# Altium schematic sheet MCU.SchDoc
size A4; SheetNumber: 2; SheetTotal: 3
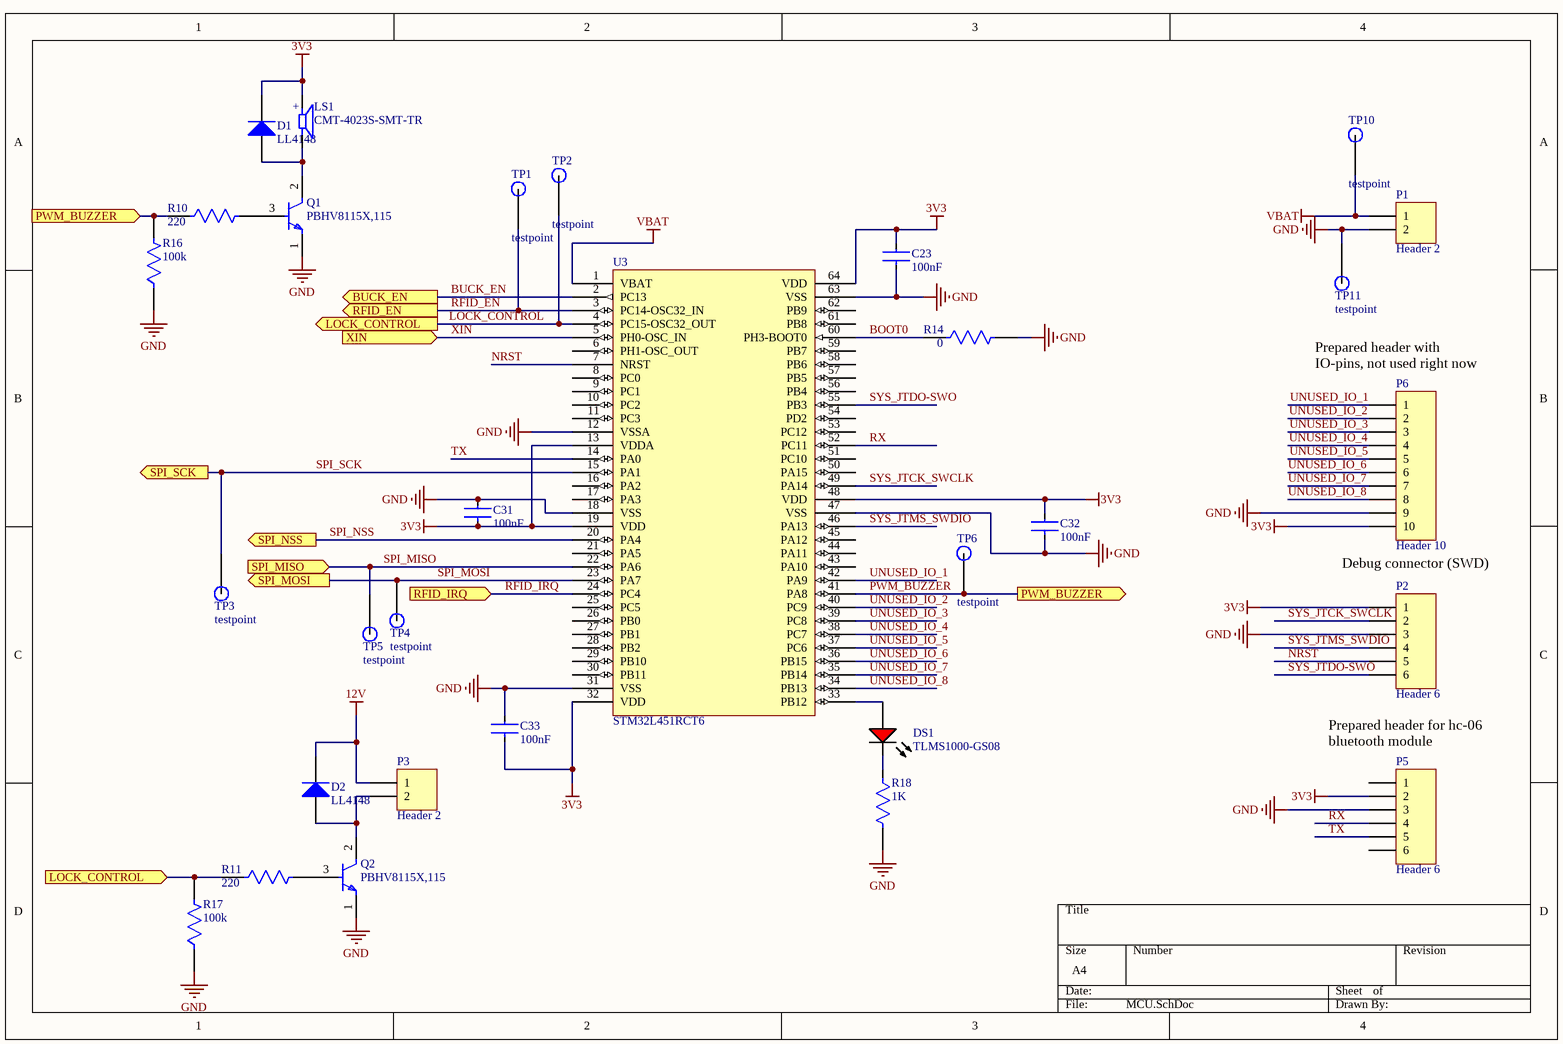
[diagram p0: MCU.SchDoc]

## Parts
C23  100nF  [FP-GCJ21B-0_3-IPC_A]
C31  100nF  [FP-GCJ21B-0_3-IPC_A]
C32  100nF  [FP-GCJ21B-0_3-IPC_A]
C33  100nF  [FP-GCJ21B-0_3-IPC_A]
D1  LL4148  [FAIR-SOD80-2_V]
D2  LL4148  [FAIR-SOD80-2_V]
DS1  TLMS1000-GS08  [VISH-TLMS1000_V]
LS1  CMT-4023S-SMT-TR  [CUI_CMT-4023S-SMT-TR]
P1  Header 2  [HDR1X2]
P2  Header 6  [HDR1X6]
P3  Header 2  [HDR1X2]
P5  Header 6  [HDR1X6]
P6  Header 10  [HDR1X10]
Q1  PBHV8115X,115  [FP-SOT89-MFG]
Q2  PBHV8115X,115  [FP-SOT89-MFG]
R10  220  [FP-AC0603-MFG]
R11  220  [FP-AC0603-MFG]
R14  0  [FP-AC0603-MFG]
R16  100k  [FP-AC0603-MFG]
R17  100k  [FP-AC0603-MFG]
R18  1K  [FP-AC0603-MFG]
TP1  testpoint  [Testpoint]
TP2  testpoint  [Testpoint]
TP3  testpoint  [Testpoint]
TP4  testpoint  [Testpoint]
TP5  testpoint  [Testpoint]
TP6  testpoint  [Testpoint]
TP10  testpoint  [Testpoint]
TP11  testpoint  [Testpoint]
U3  STM32L451RCT6  [LQFP-64]

## Ports
BUCK_EN (out), LOCK_CONTROL (in), LOCK_CONTROL (out), PWM_BUZZER (in), PWM_BUZZER (out), RFID_EN (out), RFID_IRQ (in), SPI_MISO (in), SPI_MOSI (out), SPI_NSS (out), SPI_SCK (out), XIN (in)

## Nets
3V3: C23.2 C31.1 C32.2 C33.1 D1.2(K) LS1.P P2.1 P5.2 P6.10 U3.13(VDDA) U3.19(VDD) U3.32(VDD) U3.48(VDD) U3.64(VDD)
12V: D2.2(K) P3.1
GND: C23.1 C31.2 C32.1 C33.2 P1.2 P2.3 P5.3 P6.9 Q1.1(E) Q2.1(E) R14.2 R16.1 R17.1 R18.2 TP11.1(tp) U3.12(VSSA) U3.18(VSS) U3.31(VSS) U3.47(VSS) U3.63(VSS)
VBAT: P1.1 TP10.1(tp) U3.1(VBAT)
BOOT0: R14.1 U3.60(PH3-BOOT0)
BUCK_EN: U3.2(PC13) ; port BUCK_EN
LOCK_CONTROL: R11.1 R17.2 TP2.1(tp) U3.4(PC15-OSC32_OUT) ; port LOCK_CONTROL
NRST: P2.5 U3.7(NRST)
PWM_BUZZER: R10.1 R16.2 TP6.1(tp) U3.41(PA8) ; port PWM_BUZZER
RFID_EN: TP1.1(tp) U3.3(PC14-OSC32_IN) ; port RFID_EN
RFID_IRQ: U3.24(PC4) ; port RFID_IRQ
RX: P5.4 U3.52(PC11)
SPI_MISO: TP5.1(tp) U3.22(PA6) ; port SPI_MISO
SPI_MOSI: TP4.1(tp) U3.23(PA7) ; port SPI_MOSI
SPI_NSS: U3.20(PA4) ; port SPI_NSS
SPI_SCK: TP3.1(tp) U3.15(PA1) ; port SPI_SCK
SYS_JTCK_SWCLK: P2.2 U3.49(PA14)
SYS_JTDO-SWO: P2.6 U3.55(PB3)
SYS_JTMS_SWDIO: P2.4 U3.46(PA13)
TX: P5.5 U3.14(PA0)
UNUSED_IO_1: P6.1 U3.42(PA9)
UNUSED_IO_2: P6.2 U3.40(PC9)
UNUSED_IO_3: P6.3 U3.39(PC8)
UNUSED_IO_4: P6.4 U3.38(PC7)
UNUSED_IO_5: P6.5 U3.37(PC6)
UNUSED_IO_6: P6.6 U3.36(PB15)
UNUSED_IO_7: P6.7 U3.35(PB14)
UNUSED_IO_8: P6.8 U3.34(PB13)
XIN: U3.5(PH0-OSC_IN) ; port XIN
NetD1_1: D1.1(A) LS1.N Q1.2(C)
NetD2_1: D2.1(A) P3.2 Q2.2(C)
NetDS1_1: DS1.1(A) U3.33(PB12)
NetDS1_2: DS1.2(K) R18.1
NetQ1_3: Q1.3(B) R10.2
NetQ2_3: Q2.3(B) R11.2

Not connected (* = marked no-connect by the designer): P5 1 6; U3 6(PH1-OSC_OUT) 8(PC0) 9(PC1) 10(PC2) 11(PC3) 16(PA2) 17(PA3) 21(PA5) 25(PC5) 26(PB0) 27(PB1) 28(PB2) 29(PB10) 30(PB11) 43(PA10) 44(PA11) 45(PA12) 50(PA15) 51(PC10) 53(PC12) 54(PD2) 56(PB4) 57(PB5) 58(PB6) 59(PB7) 61(PB8) 62(PB9)

## Notes on the sheet
- (near P6) Prepared header with IO-pins, not used right now
- Debug connector (SWD)
- Prepared header for hc-06 bluetooth module
- (in symbol CMT-4023S-SMT-TR) +

## Library data of the parts
C23 C31-C33 = CMP-2007-03210-2: Multilayer Ceramic Capacitors MLCC - SMD/SMT 0805 2.2uF 10%, 16VDC,  X7R 15%; Voltage Rating (DC): 16V; Thickness: 0.057inch; Lead Free: Lead Free; Dielectric: X7R; Case Code (Imperial): 0805; Packaging: Tape and Reel; Features: Soft Termination; Termination: SMD/SMT; Height: 1.25mm; Radiation Hardening: No; Capacitance: 2.2uF; Package Quantity: 1; Min Operating Temperature: -55°C; Ratings: AEC-Q200; Voltage Rating: 16V; Case/Package: 0805; Max Operating Temperature: 125°C; Depth: 1.25mm; Tolerance: 10%; Case Code (Metric): 2012; Length: 2mm; Mount: Surface Mount; Width: 0.049inch
D1 D2 = CMP-2000-05115-2: Small Signal Diode, 100 V, 0.2 A, -55 to 175 degC, 2-Pin SOD80, RoHS, Tape and Reel; Manufacturer: Fairchild; Reverse Voltage-Max [Vrrm]: 100V; Average Forward Current-Max: 200mA; Forward Voltage: 1V; Reverse Recovery Time-Max: 1ns; Power Dissipation: 500mW; Datasheet URL: https://www.fairchildsemi.com/datasheets/LL/LL4148.pdf; Manufacturer URL: https://www.fairchildsemi.com/; Datasheet Version: Rev. 1.8, 01/2016
DS1 = CMP-2000-07254-1: Low Current LED, 40 mW, 1.8 V, -40 to 100 degC, 2-Pin SMD (0603), RoHS, Tape and Reel; Manufacturer: Vishay; Lens Shape: Rectangular; Automotive Qualification Standard: AEC-Q100; Wavelength Typ: 636nm; SVHC: ToBeAdvised; LED Colour: Red; Bulb Size: 1.6mmx0.8mm; Forward Voltage: 1.8V; Luminous Intensity: 4mcd; Forward Current If: 2mA; Viewing Angle: 80°; Datasheet Version: Rev. 1.7, 02/2011; Datasheet URL: https://datasheet.ciiva.com/5798/1698881-5798337.pdf; LED Mounting: SMD; Packaging: CutTape; Package Reference: TLMS1000; Manufacturer URL: http://www.vishay.com/; Mounting Technology: SurfaceMount; Product Range: -; Package Description: 2-Pin Surface Mount Device, Body 1.6 x 0.8 mm; MSL: MSL2-1year
LS1 = CMT-4023S-SMT-TR: 4 mm, 3 Vo-p, 70 dB, Surface Mount _SMT_, Magnetic Audio Transducer Buzzer; MF: CUI Devices; Value: *; Availability: Unavailable; Package: SIP-1 CUI; Price: None; SnapEDA_Link: https://www.snapeda.com/parts/CMT-4023S-SMT-TR/CUI%20Devices/view-part/612102/?ref=snap; MP: CMT-4023S-SMT-TR; CUI_purchase_URL: https://www.cuidevices.com/product/audio/buzzers/audio-transducers/cmt-4023s-smt-tr?utm_source=snapeda.com&utm_medium=referral&utm_campaign=snapedaBOM
P1 P3 = Header 2: Header, 2-Pin; LatestRevisionDate: 17-Jul-2002; LatestRevisionNote: Re-released for DXP Platform.; Publisher: Altium Limited
P2 P5 = Header 6: Header, 6-Pin; LatestRevisionDate: 17-Jul-2002; LatestRevisionNote: Re-released for DXP Platform.; Publisher: Altium Limited
P6 = Header 10: Header, 10-Pin; LatestRevisionDate: 17-Jul-2002; LatestRevisionNote: Re-released for DXP Platform.; Publisher: Altium Limited
Q1 Q2 = CMP-14406-000018-1: TRANS NPN 150V 1A SOT89; Manufacturer: Nexperia; Number Of Npn: 1; Rise Time Tr: 565ns; Delay Time Td: 7ns; Rthja Max: 240K/W; Emitter Base Voltage: 6V; Hfe Testvce: 10V; Collector Emitter Saturation Voltage: 33mV; Hfe Min: 10; Max Junction Temp: +150°C; Gain Bandwidth Product: 30MHz; Automotive Grade: Grade 0; Power Dissipation: 0.52W; Collector Base Voltage: 400V; Fall Time Tf: 700ns; Category: Trans; Lead Free: Yes; Number Of Elements: 1; Ambient Temperature Range Low: -55°C; Height: 1.6mm; Temperature: to +150°C; Max Collector Current: 1A; Manufacturer Part Number: PBHV8115X,115; Device Class L3: BJTs; ComponentLink2URL: https://assets.nexperia.com/documents/data-sheet/PBHV8115X.pdf; Collector Emitter Voltage: 150V; Device Class L1: Discrete Semiconductors; Package: SOT89; Storage Time Ts: 1530ns; Ambient Temperature Range High: +150°C; Digikey Description: TRANS NPN 150V 1A SOT89; ComponentLink2Description: Datasheet; Footprint Url: https://assets.nexperia.com/documents/outline-drawing/SOT89.pdf; Device Class L2: Transistors; RoHS: TRUE; Automotive: Yes; Temperature Range High: +150°C; Octopart: https://octopart.com/pbhv8115x%2C115-nexperia-78740688; Hfe Testic: 1A
R10 R11 R14 R16-R18 = CMP-03412-025180-1: RES SMD 60.4 OHM 1% 1/10W 0603; Manufacturer Part Number: AC0603FR-0760R4L; Manufacturer: Yageo; Automotive Grade: Grade 0; Value: 60.4Ω; Power Rating: 0.1W; Voltage Rating: 75V; Tolerance: 0.01; Automotive: Yes; Category: Res; Mouser Description: Res Thick Film 0603 60.4 Ohm 1% 0.1W(1/10W) ±100ppm/C Epoxy Pad SMD Automotive T/R; Height: 0.55mm; Temperature: -55°C to +155°C; Resistance: 60.4Ω; Package: AC0603; Device Class L3: Chip SMD Resistors; ComponentLink2URL: http://www.yageo.com/NewPortal/yageodocoutput?fileName=/pdf/R-Chip/PYu-AC_51_RoHS_L_6.pdf; Composition: Thick Film; Octopart: https://octopart.com/ac0603fr-0760r4l-yageo-71367350; Temperature Range Low: -55°C; Lead Free: Yes; Footprint Url: http://www.yageo.com/exep/pages/download/literatures/PYu-R_Mount_9.pdf; ComponentLink2Description: Datasheet; Series: AC; Device Class L1: Passive Components; Device Class L2: Resistors; Temperature Range High: +155°C; RoHS: TRUE; Digikey Description: RES SMD 60.4 OHM 1% 1/10W 0603; Ipc Land Pattern Name: RESC16080X45
U3 = STM32L451RCT6: MCU 32-bit STM32; Manufacturer: STMicroelectronics; Manufacturer Part Number: STM32L451RCT6; RoHS: Yes; Category: Microcontrollers